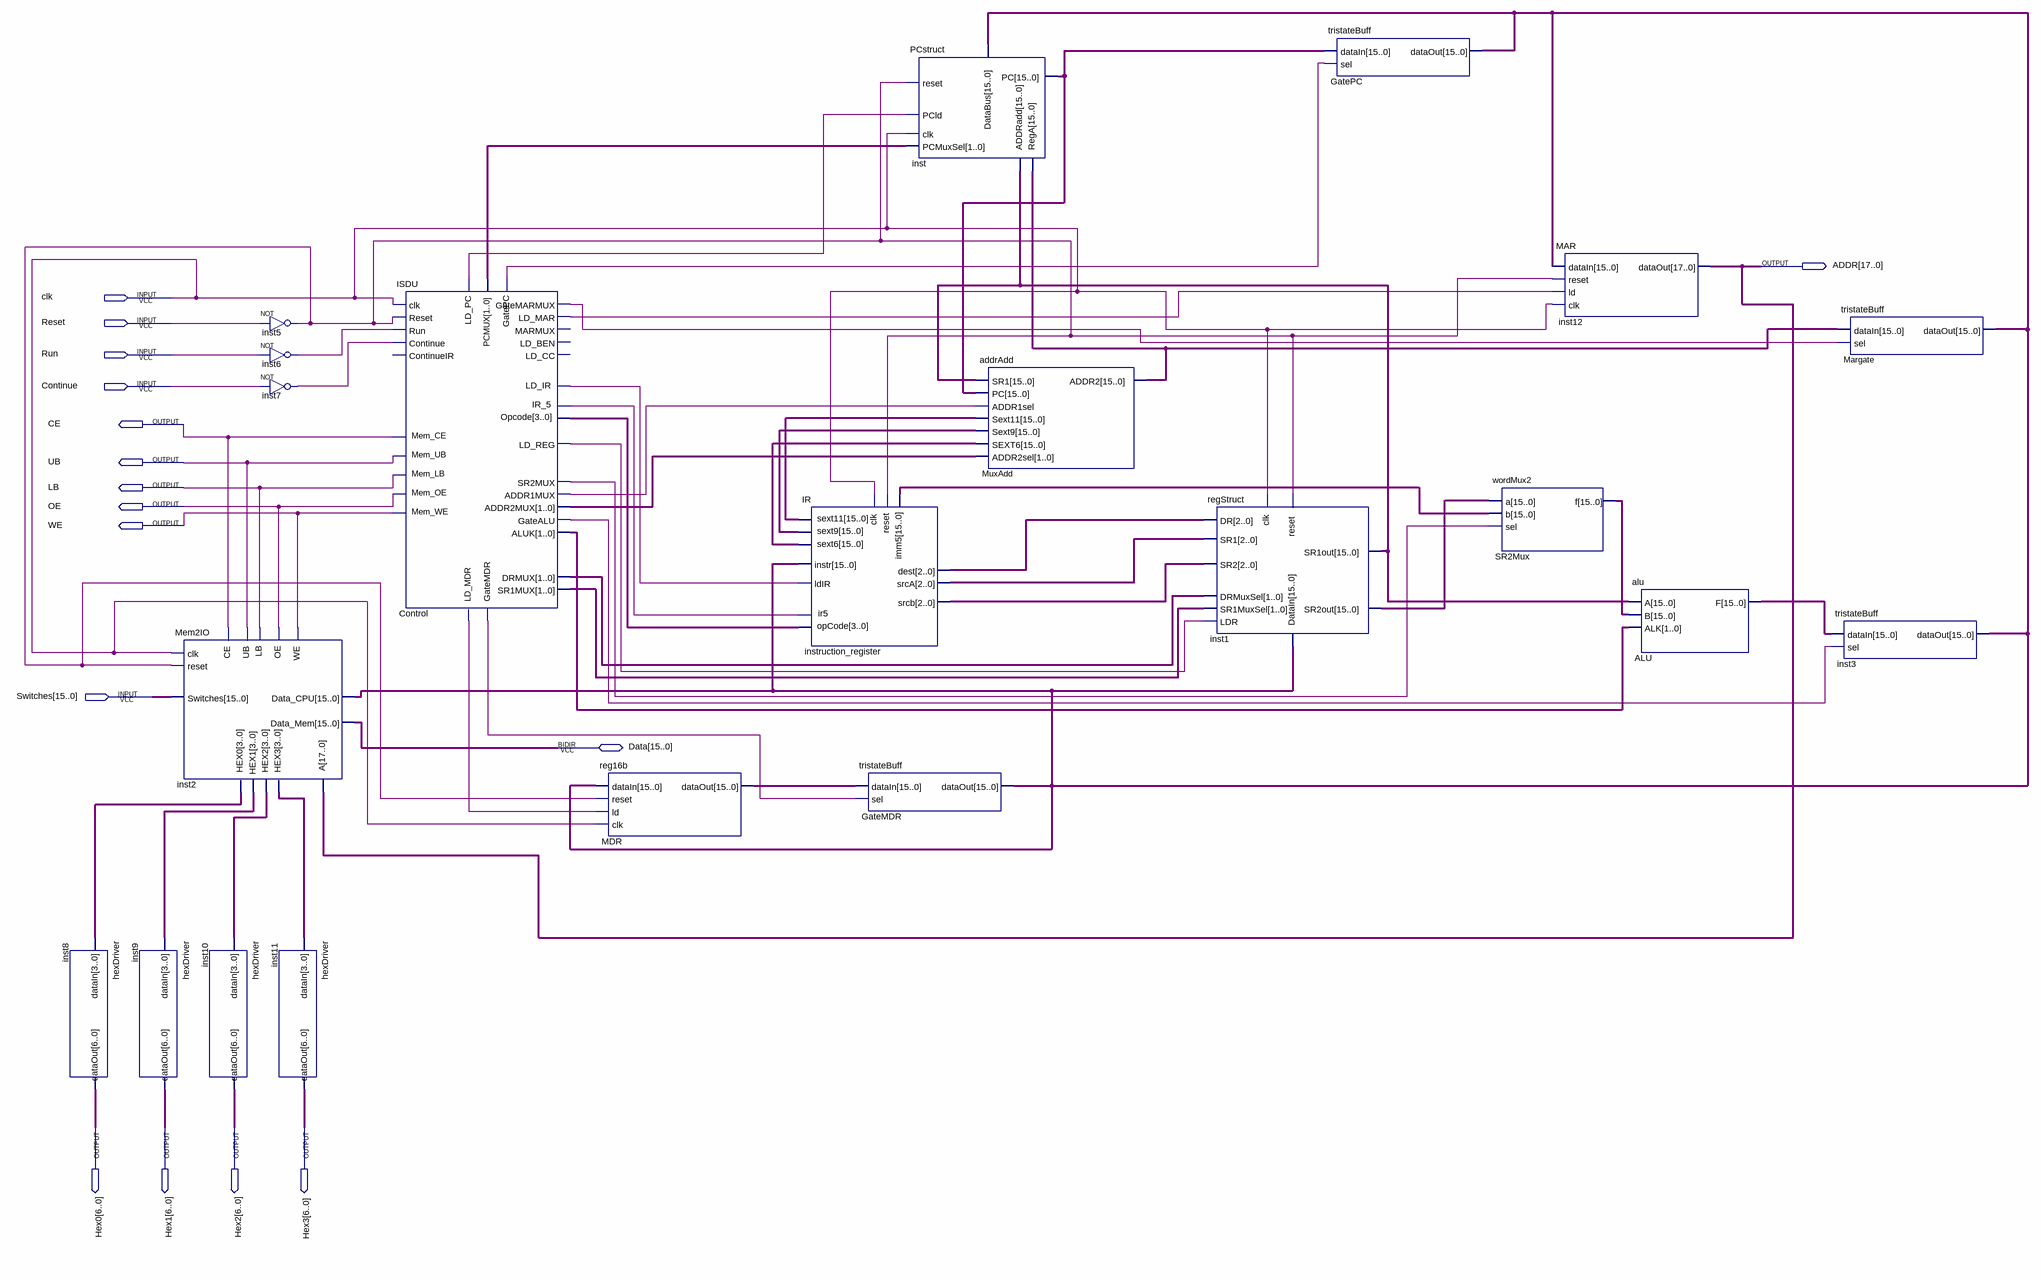
[diagram p0: schematic sheet]
// Quartus schematic datapath.bdf as structural Verilog: 21 symbols, 16 pins
module datapath (
  input  clk,
  input  Reset,
  input  Run,
  input  Continue,
  input  [15:0] Switches,
  inout  [15:0] Data,
  output [17:0] ADDR,
  output CE,
  output UB,
  output LB,
  output OE,
  output WE,
  output [6:0] Hex0,
  output [6:0] Hex1,
  output [6:0] Hex2,
  output [6:0] Hex3
);

  wire Control_addr1mux, Control_gatealu, Control_gatemarmux, Control_gatemdr, Control_gatepc, Control_ld_ir,
       Control_ld_mar, Control_ld_mdr, Control_ld_pc, Control_ld_reg, Control_sr2mux, inst5_out, inst6_out,
       inst7_out, instruction_register_ir5;
  wire [1:0] Control_addr2mux, Control_aluk, Control_drmux, Control_pcmux, Control_sr1mux;
  wire [2:0] instruction_register_dest, instruction_register_srca, instruction_register_srcb;
  wire [3:0] inst2_hex0, inst2_hex1, inst2_hex2, inst2_hex3, instruction_register_opcode;
  wire [15:0] ALU_f, inst1_sr1out, inst1_sr2out, inst2_data_cpu, inst_pc, instruction_register_imm5,
       instruction_register_sext6, instruction_register_sext9, instruction_register_sext11, MDR_dataout,
       MuxAdd_addr2, SR2Mux_f;

  hexDriver inst8 (.dataIn(inst2_hex0), .dataOut(Hex0));
  hexDriver inst9 (.dataIn(inst2_hex1), .dataOut(Hex1));
  Mem2IO inst2 (
    .clk(clk), .reset(inst5_out), .A(ADDR), .CE(CE), .UB(UB), .LB(LB), .OE(OE), .WE(WE), .Switches(Switches),
    .HEX0(inst2_hex0), .HEX1(inst2_hex1), .HEX2(inst2_hex2), .HEX3(inst2_hex3), .Data_CPU(inst2_data_cpu),
    .Data_Mem(Data));
  hexDriver inst10 (.dataIn(inst2_hex2), .dataOut(Hex2));
  not inst5 (inst5_out, Reset);
  not inst6 (inst6_out, Run);
  not inst7 (inst7_out, Continue);
  hexDriver inst11 (.dataIn(inst2_hex3), .dataOut(Hex3));
  ISDU Control (
    .clk(clk), .Reset(inst5_out), .Run(inst6_out), .Continue(inst7_out),
    .Opcode(instruction_register_opcode), .IR_5(instruction_register_ir5), .LD_MAR(Control_ld_mar),
    .LD_MDR(Control_ld_mdr), .LD_IR(Control_ld_ir), .LD_REG(Control_ld_reg), .LD_PC(Control_ld_pc),
    .GatePC(Control_gatepc), .GateMDR(Control_gatemdr), .GateALU(Control_gatealu),
    .GateMARMUX(Control_gatemarmux), .PCMUX(Control_pcmux), .DRMUX(Control_drmux), .SR1MUX(Control_sr1mux),
    .SR2MUX(Control_sr2mux), .ADDR1MUX(Control_addr1mux), .ADDR2MUX(Control_addr2mux), .ALUK(Control_aluk),
    .Mem_CE(CE), .Mem_UB(UB), .Mem_LB(LB), .Mem_OE(OE), .Mem_WE(WE));  // open: ContinueIR, LD_BEN, LD_CC, MARMUX
  reg16b MDR (.dataIn(inst2_data_cpu), .reset(inst5_out), .ld(Control_ld_mdr), .clk(clk), .dataOut(MDR_dataout));
  IR instruction_register (
    .instr(inst2_data_cpu), .ldIR(Control_ld_ir), .clk(clk), .reset(inst5_out),
    .ir5(instruction_register_ir5), .dest(instruction_register_dest), .srcA(instruction_register_srca),
    .srcb(instruction_register_srcb), .opCode(instruction_register_opcode), .imm5(instruction_register_imm5),
    .sext6(instruction_register_sext6), .sext9(instruction_register_sext9),
    .sext11(instruction_register_sext11));
  tristateBuff GateMDR (.dataIn(MDR_dataout), .sel(Control_gatemdr), .dataOut(inst2_data_cpu));
  PCstruct inst (
    .DataBus(inst2_data_cpu), .reset(inst5_out), .RegA(MuxAdd_addr2), .PCld(Control_ld_pc),
    .ADDRadd(inst1_sr1out), .clk(clk), .PCMuxSel(Control_pcmux), .PC(inst_pc));
  addrAdd MuxAdd (
    .SR1(inst1_sr1out), .PC(inst_pc), .ADDR1sel(Control_addr1mux), .Sext11(instruction_register_sext11),
    .Sext9(instruction_register_sext9), .SEXT6(instruction_register_sext6), .ADDR2sel(Control_addr2mux),
    .ADDR2(MuxAdd_addr2));
  regStruct inst1 (
    .reset(inst5_out), .clk(clk), .DR(instruction_register_dest), .DRMuxSel(Control_drmux),
    .SR1(instruction_register_srca), .SR1MuxSel(Control_sr1mux), .SR2(instruction_register_srcb),
    .LDR(Control_ld_reg), .DataIn(inst2_data_cpu), .SR1out(inst1_sr1out), .SR2out(inst1_sr2out));
  tristateBuff GatePC (.dataIn(inst_pc), .sel(Control_gatepc), .dataOut(inst2_data_cpu));
  wordMux2 SR2Mux (.a(inst1_sr2out), .b(instruction_register_imm5), .sel(Control_sr2mux), .f(SR2Mux_f));
  MAR inst12 (.dataIn(inst2_data_cpu), .reset(inst5_out), .ld(Control_ld_mar), .clk(clk), .dataOut(ADDR));
  alu ALU (.A(inst1_sr1out), .B(SR2Mux_f), .ALK(Control_aluk), .F(ALU_f));
  tristateBuff Margate (.dataIn(MuxAdd_addr2), .sel(Control_gatemarmux), .dataOut(inst2_data_cpu));
  tristateBuff inst3 (.dataIn(ALU_f), .sel(Control_gatealu), .dataOut(inst2_data_cpu));
endmodule
